# EAGLE schematic Multi (EAGLE 7.6.0)
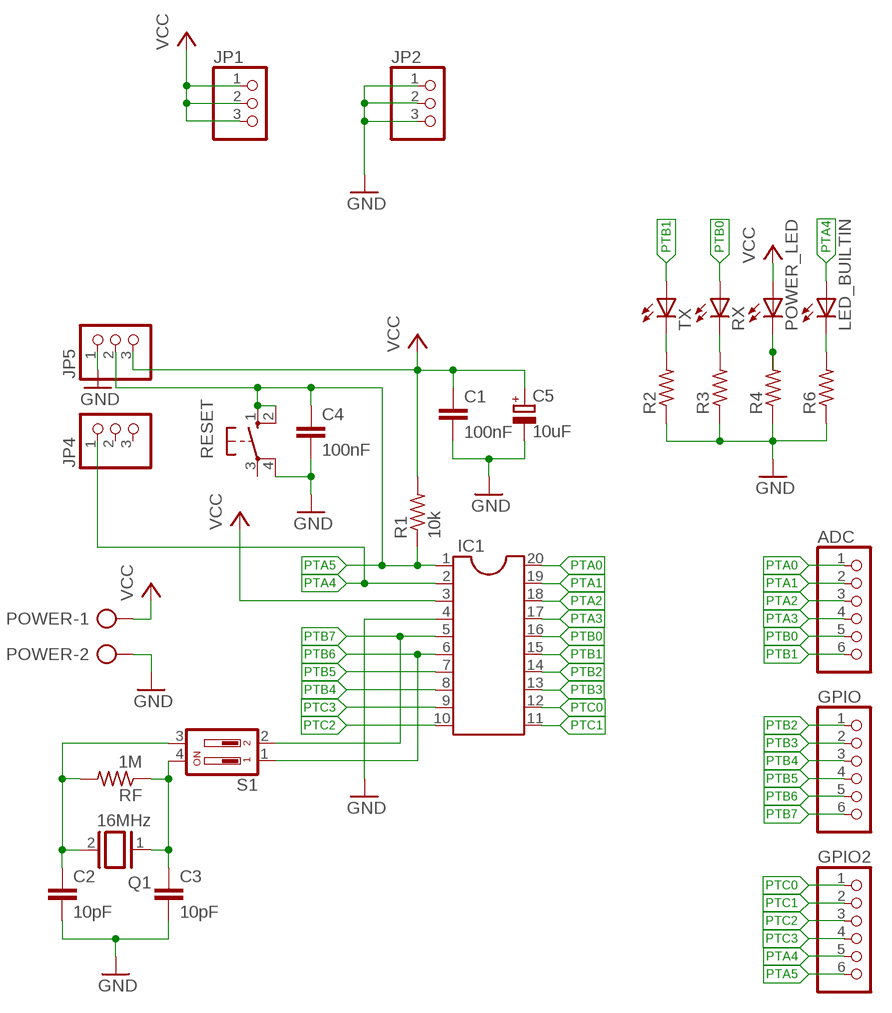
[diagram p0: schematic, sheet 1]

## Parts
ADC  PINHD-1X6  [1X06]
C1  100nF  C-EU025-025X050  [C025-025X050]
C2  10pF  C-EU025-025X050  [C025-025X050]
C3  10pF  C-EU025-025X050  [C025-025X050]
C4  100nF  C-EU025-025X050  [C025-025X050]
C5  10uF  CPOL-EUE2.5-6  [E2,5-6]
GPIO  PINHD-1X6  [1X06]
GPIO2  PINHD-1X6  [1X06]
IC1  DIL20S  [SOCKET-20]
JP1  PINHD-1X3  [1X03]
JP2  PINHD-1X3  [1X03]
JP4  PINHD-1X3  [1X03]
JP5  PINHD-1X3  [1X03]
LED_BUILTIN  LED3MM  [LED3MM]
POWER  AK500/2-H  [AK500/2-H]
POWER_LED  LED3MM  [LED3MM]
Q1  16MHz  XTAL/S  [QS]
R1  10k  R-US_0207/7  [0207/7]
R2  R-US_0207/7  [0207/7]
R3  R-US_0207/7  [0207/7]
R4  R-US_0207/7  [0207/7]
R6  R-US_0207/7  [0207/7]
RESET  10-XX  [B3F-10XX]
RF  1M  R-US_0207/7  [0207/7]
RX  LED3MM  [LED3MM]
S1  DS02  [DS-02]
TX  LED3MM  [LED3MM]

## Nets
GND: C1.2 C2.2 C3.2 C4.2 C5.- IC1.4 JP2.1 JP2.2 JP2.3 JP5.1 POWER.2 R2.1 R3.1 R4.1 R6.1 RESET.4(P1)
N$5: C2.1 Q1.2 RF.2 S1.3
N$6: C3.1 Q1.1 RF.1 S1.4
N$8: R2.2 TX.K(C)
N$9: R3.2 RX.K(C)
N$10: POWER_LED.K(C) R4.2
N$11: LED_BUILTIN.K(C) R6.2
PTA0: ADC.1 IC1.20
PTA1: ADC.2 IC1.19
PTA2: ADC.3 IC1.18
PTA3: ADC.4 IC1.17
PTA4: GPIO2.5 IC1.2 JP4.1 LED_BUILTIN.A
PTA5: C4.1 GPIO2.6 IC1.1 JP5.2 R1.1 RESET.1(S) RESET.2(S1)
PTB0: ADC.5 IC1.16 RX.A
PTB1: ADC.6 IC1.15 TX.A
PTB2: GPIO.1 IC1.14
PTB3: GPIO.2 IC1.13
PTB4: GPIO.3 IC1.8
PTB5: GPIO.4 IC1.7
PTB6: GPIO.5 IC1.6 S1.1
PTB7: GPIO.6 IC1.5 S1.2
PTC0: GPIO2.1 IC1.12
PTC1: GPIO2.2 IC1.11
PTC2: GPIO2.3 IC1.10
PTC3: GPIO2.4 IC1.9
VCC: C1.1 C5.+ IC1.3 JP1.1 JP1.2 JP1.3 JP5.3 POWER.1 POWER_LED.A R1.2
Unconnected: JP4.2 JP4.3 RESET.3(P)

## Library data of the parts
ADC GPIO GPIO2 = pinhead:PINHD-1X6: PIN HEADER
C1-C4 = rcl:C-EU: CAPACITOR, European symbol
C5 = rcl:CPOL-EU: POLARIZED CAPACITOR, European symbol
IC1 = ic-package:DIL20: Dual In Line / Socket
JP1 JP2 JP4 JP5 = pinhead:PINHD-1X3: PIN HEADER
LED_BUILTIN POWER_LED RX TX = led:LED: LED OSRAM: - CHIPLED LG R971, LG N971, LY N971, LG Q971, LY Q971, LO R971, LY R971 LH N974, LH R974 LS Q976, LO Q976, LY Q976 LO Q996 - Hyper CHIPLED LW Q18S LB Q993, LB Q99A, LB R99A - SideLED LS A670, LO A670, LY A670, LG A670, LP A670 LB A673, LV A673, LT A673, LW A673 LH A674 LY A675 LS A676, LA A676, LO A676, LY A676, LW A676 LS A679, LY A679, LG A679 - Hyper Micro SIDELED® LS Y876, LA Y876, LO Y876, LY Y876 LT Y87S - SmartLED LW L88C, LW L88S LB L89C, LB L89S, LG L890 LS L89K, LO L89K, LY L89K LS L896, LA L896, LO L896, LY L896 - TOPLED LS T670, LO T670, LY T670, LG T670, LP T670 LSG T670, LSP T670, LSY T670, LOP T670, LYG T670 LG T671, LOG T671, LSG T671 LB T673, LV T673, LT T673, LW T673 LH T674 LS T676, LA T676, LO T676, LY T676, LB T676, LH T676, LSB T676, LW T676 LB T67C, LV T67C, LT T67C, LS T67K, LO T67K, LY T67K, LW E67C LS E67B, LA E67B, LO E67B, LY E67B, LB E67C, LV E67C, LT E67C LW T67C LS T679, LY T679, LG T679 LS T770, LO T770, LY T770, LG T770, LP T770 LB T773, LV T773, LT T773, LW T773 LH T774 LS E675, LA E675, LY E675, LS T675 LS T776, LA T776, LO T776, LY T776, LB T776 LHGB T686 LT T68C, LB T68C - Hyper Mini TOPLED® LB M676 - Mini TOPLED Santana® LG M470 LS M47K, LO M47K, LY M47K Source: http://www.osram.convergy.de LUXEON: - LUMILED® LXK2-PW12-R00, LXK2-PW12-S00, LXK2-PW14-U00, LXK2-PW14-V00 LXK2-PM12-R00, LXK2-PM12-S00, LXK2-PM14-U00 LXK2-PE12-Q00, LXK2-PE12-R00, LXK2-PE12-S00, LXK2-PE14-T00, LXK2-PE14-U00 LXK2-PB12-K00, LXK2-PB12-L00, LXK2-PB12-M00, LXK2-PB14-N00, LXK2-PB14-P00, LXK2-PB14-Q00 LXK2-PR12-L00, LXK2-PR12-M00, LXK2-PR14-Q00, LXK2-PR14-R00 LXK2-PD12-Q00, LXK2-PD12-R00, LXK2-PD12-S00 LXK2-PH12-R00, LXK2-PH12-S00 LXK2-PL12-P00, LXK2-PL12-Q00, LXK2-PL12-R00 Source: www.luxeon.com KINGBRIGHT: KA-3528ASYC Source: www.kingbright.com
POWER = con-ptr500:AK500/2-H: CONNECTOR Aug. 2004 / PTR Meßtechnik: Die Bezeichnung der Serie AK505 wurde geändert. Es handelt sich hierbei um AK500 in horizontaler Ausführung.; OC_FARNELL: unknown; OC_NEWARK: unknown
Q1 = special:XTAL/S: CRYSTAL
R1-R4 R6 RF = rcl:R-US_: RESISTOR, American symbol
RESET = switch-omron:10-XX: OMRON SWITCH; MPN: B3F-1000; OC_FARNELL: 176432; OC_NEWARK: 36M3542
S1 = switch-dil:DS02: DIL/CODE SWITCH; OC_FARNELL: 9472126; OC_NEWARK: unknown